# EAGLE design ADC_FPGA_CONN (EAGLE 5.11)
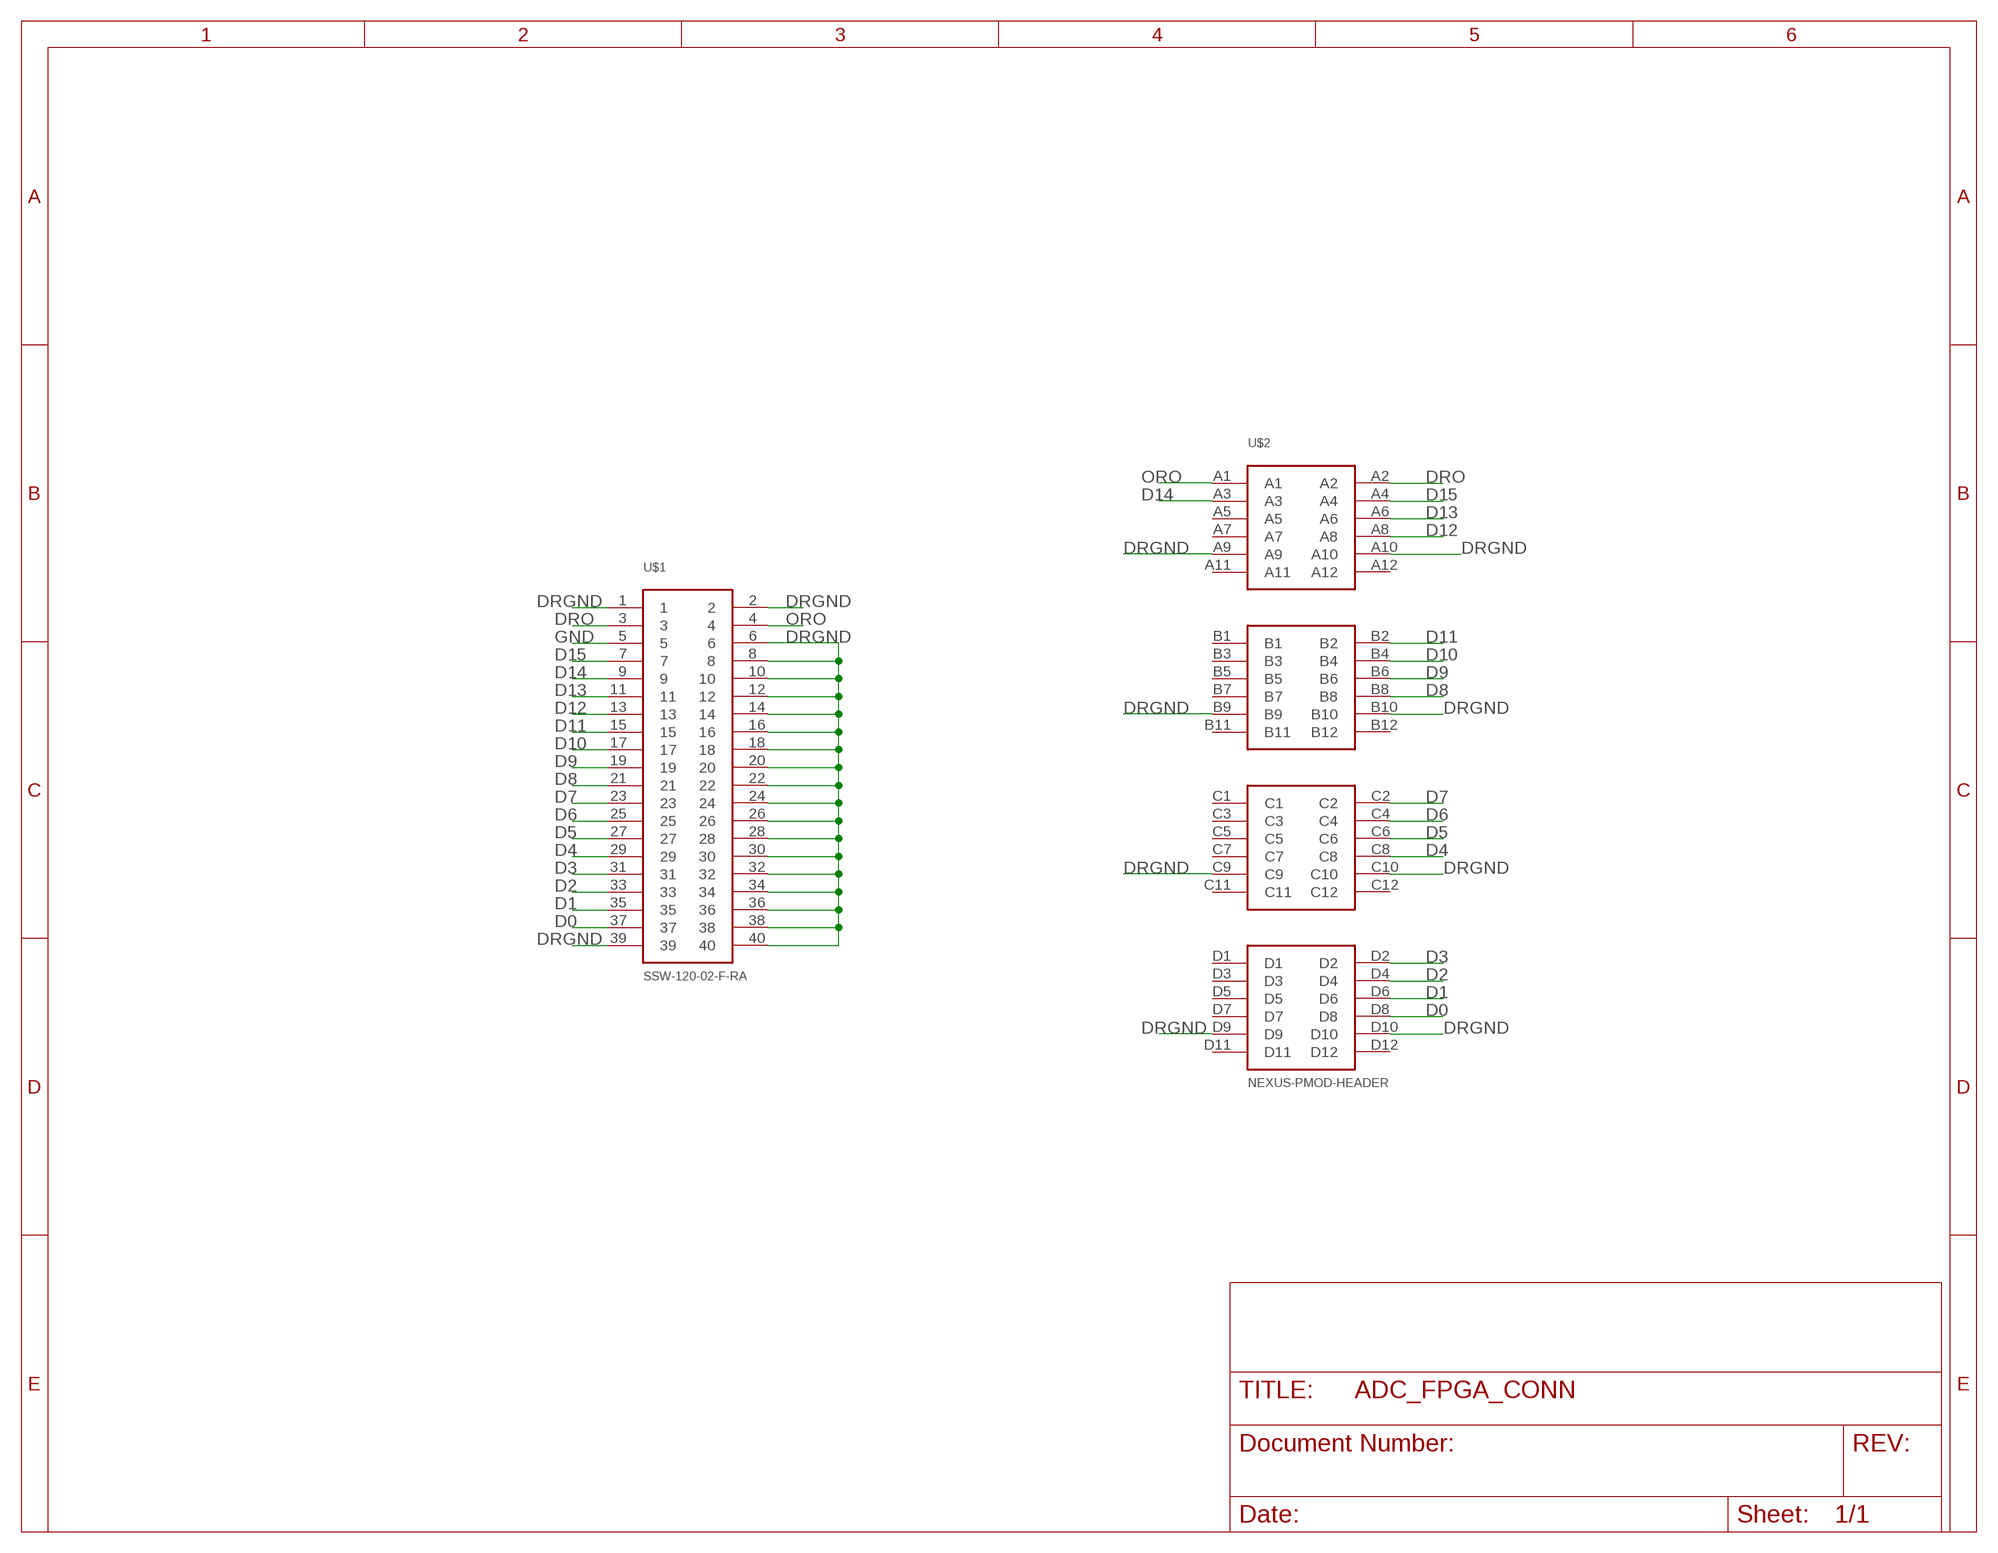
[diagram p0: schematic, sheet 1]

## Parts
U$1  SSW-120-02-F-RA  [40-2.54MX2.54M]
U$2  NEXUS-PMOD-HEADER  [NEXUS-PMOD-HEADERS]

## Nets
D0: U$1.37 U$2.D8
D1: U$1.35 U$2.D6
D2: U$1.33 U$2.D4
D3: U$1.31 U$2.D2
D4: U$1.29 U$2.C8
D5: U$1.27 U$2.C6
D6: U$1.25 U$2.C4
D7: U$1.23 U$2.C2
D8: U$1.21 U$2.B8
D9: U$1.19 U$2.B6
D10: U$1.17 U$2.B4
D11: U$1.15 U$2.B2
D12: U$1.13 U$2.A8
D13: U$1.11 U$2.A6
D14: U$1.9 U$2.A3
D15: U$1.7 U$2.A4
DRGND: U$1.1 U$1.2 U$1.6 U$1.8 U$1.10 U$1.12 U$1.14 U$1.16 U$1.18 U$1.20 U$1.22 U$1.24 U$1.26 U$1.28 U$1.30 U$1.32 U$1.34 U$1.36 U$1.38 U$1.39 U$1.40 U$2.A9 U$2.A10 U$2.B9 U$2.B10 U$2.C9 U$2.C10 U$2.D9 U$2.D10
DRO: U$1.3 U$2.A2
GND: U$1.5
ORO: U$1.4 U$2.A1
Unconnected: U$2.A5 U$2.A7 U$2.A11 U$2.A12 U$2.B1 U$2.B3 U$2.B5 U$2.B7 U$2.B11 U$2.B12 U$2.C1 U$2.C3 U$2.C5 U$2.C7 U$2.C11 U$2.C12 U$2.D1 U$2.D3 U$2.D5 U$2.D7 U$2.D11 U$2.D12

## Library data of the parts
U$1 = untitled:SSW-120-02-F-RA
U$2 = untitled:NEXUS-PMOD-HEADER

## Board
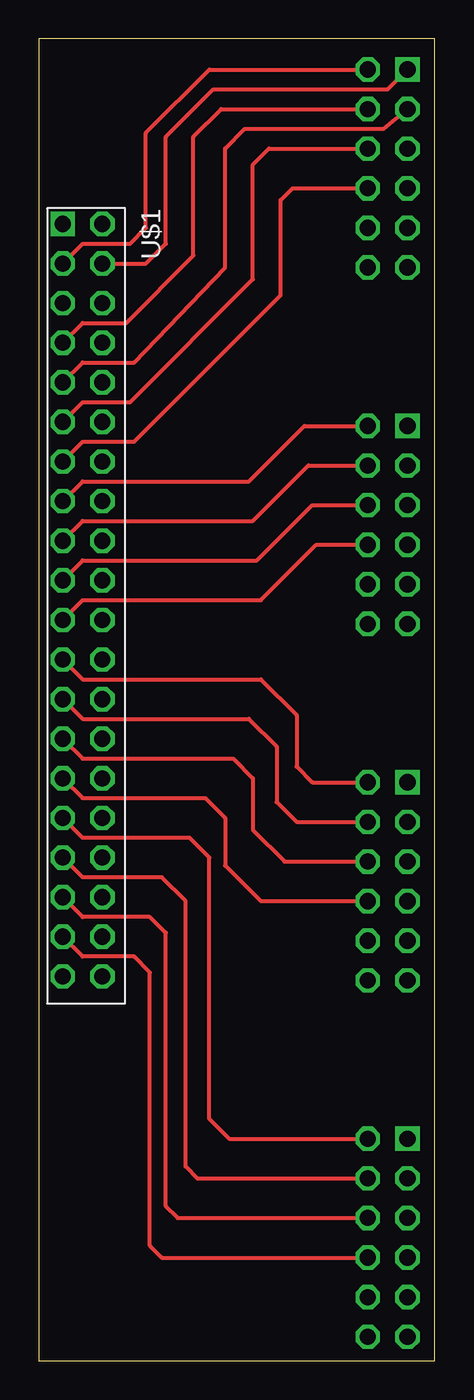
[diagram p1: board, top side]
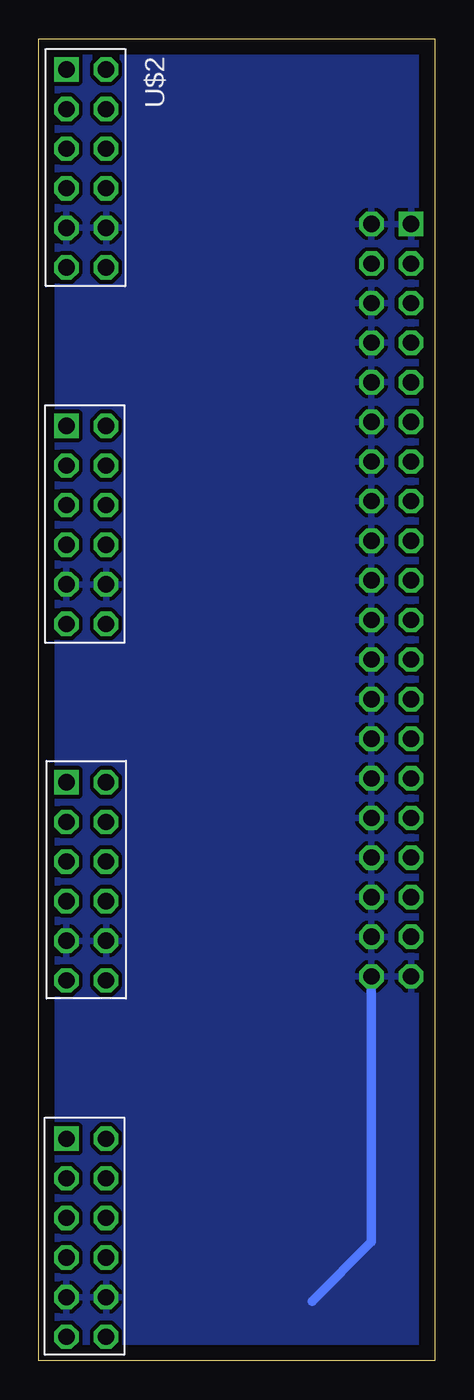
[diagram p2: board, bottom side, seen from below]

Size 25.38 x 84.76 mm. Coordinates in mm from the lower left corner, seen from the top.
Outline: 0,0 25.38,0 25.38,84.76 0,84.76 0,0
Copper layers (1*16): Top 0.035mm / dielectric 1.5mm / Bottom 0.035mm
Design rules "default *": minimum track width 10mil, minimum drill 24mil, track to track 8mil, track to pad 8mil, pad to pad 8mil, via to via 8mil, smd to smd 8mil, copper to edge 40mil, drill to drill 8mil, minimum pad ring 10mil, minimum via ring 8mil, stop-mask expansion 4mil, vias tented up to drill 0mil, thermal gap 10mil

### Footprints (pad centres in the part's own frame; a part is rotated, then mirrored left to right if it is on the bottom)
40-2.54MX2.54M = drill 1.04 square: 1 0,0 | drill 1.04 octagon: 2 0,2.54; 3 2.54,0; 4 2.54,2.54; 5 5.08,0; 6 5.08,2.54; 7 7.62,0; 8 7.62,2.54; 9 10.16,0; 10 10.16,2.54; 11 12.7,0; 12 12.7,2.54; 13 15.24,0; 14 15.24,2.54; 15 17.78,0; 16 17.78,2.54; 17 20.32,0; 18 20.32,2.54; 19 22.86,0; 20 22.86,2.54; 21 25.4,0; 22 25.4,2.54; 23 27.94,0; 24 27.94,2.54; 25 30.48,0; 26 30.48,2.54; 27 33.02,0; 28 33.02,2.54; 29 35.56,0; 30 35.56,2.54; 31 38.1,0; 32 38.1,2.54; 33 40.64,0; 34 40.64,2.54; 35 43.18,0; 36 43.18,2.54; 37 45.72,0; 38 45.72,2.54; 39 48.26,0; 40 48.26,2.54
NEXUS-PMOD-HEADERS = drill 1.04 square: A1 0,0; B1 22.86,0; C1 45.72,0; D1 68.58,0 | drill 1.04 octagon: A2 0,2.54; A3 2.54,0; A4 2.54,2.54; A5 5.08,0; A6 5.08,2.54; A7 7.62,0; A8 7.62,2.54; A9 10.16,0; A10 10.16,2.54; A11 12.7,0; A12 12.7,2.54; B2 22.86,2.54; B3 25.4,0; B4 25.4,2.54; B5 27.94,0; B6 27.94,2.54; B7 30.48,0; B8 30.48,2.54; B9 33.02,0; B10 33.02,2.54; B11 35.56,0; B12 35.56,2.54; C2 45.72,2.54; C3 48.26,0; C4 48.26,2.54; C5 50.8,0; C6 50.8,2.54; C7 53.34,0; C8 53.34,2.54; C9 55.88,0; C10 55.88,2.54; C11 58.42,0; C12 58.42,2.54; D2 68.58,2.54; D3 71.12,0; D4 71.12,2.54; D5 73.66,0; D6 73.66,2.54; D7 76.2,0; D8 76.2,2.54; D9 78.74,0; D10 78.74,2.54; D11 81.28,0; D12 81.28,2.54

### Placement (x,y rotation side)
U$1  1.52,72.9 270 top
U$2  23.62,82.8 270 bottom

### Tracks (layer width: path | path; a pad name or v marks a point on that pad's centre or on a via)
D0
  Top 0.254: U$1.37 2.79,25.91 6.1,25.91 7.11,24.89 7.11,7.37 7.87,6.6 U$2.D8
D1
  Top 0.254: U$1.35 2.79,28.45 7.11,28.45 8.13,27.43 8.13,9.91 8.89,9.14 U$2.D6
D2
  Top 0.254: U$1.33 2.79,30.99 7.87,30.99 9.4,29.46 9.4,12.45 10.16,11.68 U$2.D4
D3
  Top 0.254: U$1.31 2.79,33.53 9.65,33.53 10.92,32.26 10.92,15.49 12.19,14.22 U$2.D2
D4
  Top 0.254: U$1.29 2.79,36.07 10.67,36.07 11.94,34.8 11.94,31.75 14.22,29.46 U$2.C8
D5
  Top 0.254: U$1.27 2.79,38.61 12.45,38.61 13.72,37.34 13.72,34.04 15.75,32 U$2.C6
D6
  Top 0.254: U$1.25 2.79,41.15 13.46,41.15 15.24,39.37 15.24,35.81 16.51,34.54 U$2.C4
D7
  Top 0.254: U$1.23 2.79,43.69 14.22,43.69 16.51,41.4 16.51,38.1 17.53,37.08 U$2.C2
D8
  Top 0.254: U$1.21 2.79,48.77 14.22,48.77 17.78,52.32 U$2.B8
D9
  Top 0.254: U$1.19 2.79,51.31 13.97,51.31 17.53,54.86 U$2.B6
D10
  Top 0.254: U$1.17 2.79,53.85 13.72,53.85 17.27,57.4 U$2.B4
D11
  Top 0.254: U$1.15 2.79,56.39 13.46,56.39 17.02,59.94 U$2.B2
D12
  Top 0.254: U$1.13 2.79,58.93 6.1,58.93 15.49,68.33 15.49,74.42 16.26,75.18 U$2.A8
D13
  Top 0.254: U$1.11 2.79,61.47 5.84,61.47 13.72,69.34 13.72,76.71 14.73,77.72 U$2.A6
D14
  Top 0.254: U$1.9 2.79,64.01 6.1,64.01 11.94,70.1 11.94,77.72 13.21,78.99 22.1,78.99 U$2.A3
D15
  Top 0.254: U$1.7 2.79,66.55 5.59,66.55 9.91,70.87 9.91,78.49 11.68,80.26 U$2.A4
DRGND
  Bottom 0.61: 7.87,3.81 4.06,7.62 U$1.40
  pour Bottom (isolate 0.254): 0,84.84 25.65,84.58 25.65,0 0,0
DRO
  Top 0.254: U$1.3 2.79,71.63 5.84,71.63 6.86,72.64 6.86,78.74 10.92,82.8 U$2.A2
ORO
  Top 0.254: U$1.4 6.86,70.36 8.13,71.63 8.13,78.49 11.18,81.53 22.35,81.53 U$2.A1